# EAGLE design 2021-04-14 BOSS-RoboClaw-Breakout (EAGLE 9.6.2)
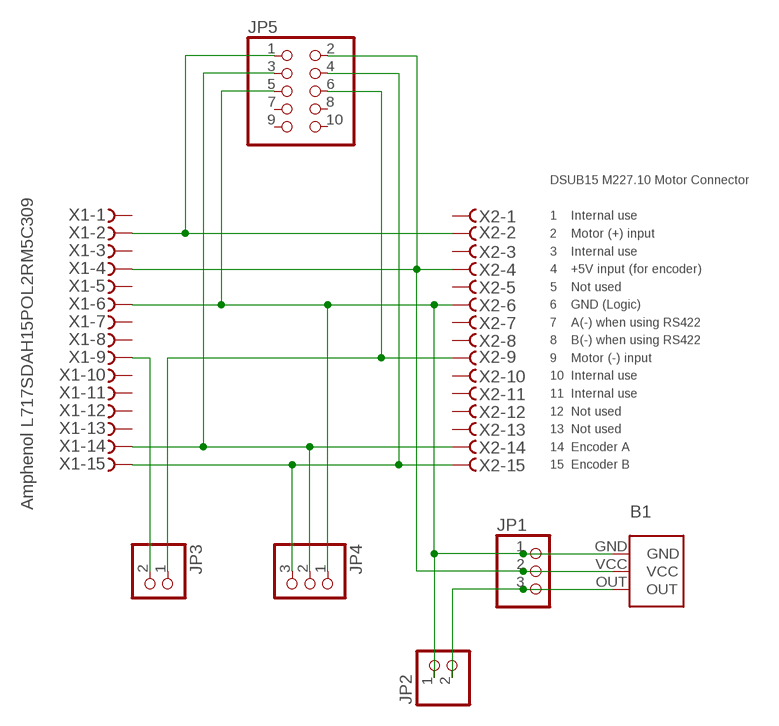
[diagram p0: schematic, sheet 1]

## Parts
B1  ACS724CARRIER  [ACS724CARRIER]
JP1  PINHD-1X3  [1X03]
JP2  PINHD-1X2  [1X02]
JP3  PINHD-1X2  [1X02]
JP4  PINHD-1X3  [1X03]
JP5  PINHD-2X5  [2X05]
X1  Amphenol L717SDAH15POL2RM5C309  D-SUB15-H2M15ST  [H2M15ST]
X2  Amphenol L77SDAH15SOL2RM8C309  D-SUB15-H2R15ST  [H2R15ST]

## Nets
ENCA: JP4.2 JP5.3 X1.14 X2.14
ENCB: JP4.3 JP5.4 X1.15 X2.15
GND: B1.GND JP1.1 JP2.1 JP4.1 JP5.5 X1.6 X2.6
M+: JP5.1 X1.2 X2.2
M-: JP3.1 JP5.6 X2.9
N$5: JP3.2 X1.9
OUT: B1.OUT JP1.3 JP2.2
VCC: B1.VCC JP1.2 JP5.2 X1.4 X2.4
Unconnected: JP5.7 JP5.8 JP5.9 JP5.10 X1.1 X1.3 X1.5 X1.7 X1.8 X1.10 X1.11 X1.12 X1.13 X2.1 X2.3 X2.5 X2.7 X2.8 X2.10 X2.11 X2.12 X2.13

## Notes on the sheet
- DSUB15 M227.10 Motor Connector
  
  1    Internal use
  2    Motor (+) input
  3    Internal use
  4    +5V input (for encoder)
  5    Not used
  6    GND (Logic)
  7    A(-) when using RS422
  8    B(-) when using RS422
  9    Motor (-) input
  10  Internal use
  11  Internal use
  12  Not used
  13  Not used
  14  Encoder A
  15  Encoder B

## Library data of the parts
B1 = AUmlib:ACS724CARRIER: Pololu ACS724 carrier board Pololu part 4041 is +/-5A 400mV/A
JP1 JP4 = AUmlib:PINHD-1X3: PIN HEADER
JP2 JP3 = AUmlib:PINHD-1X2: PIN HEADER
JP5 = AUmlib:PINHD-2X5: PIN HEADER
X1 X2 = AUmlib:D-SUB15-: D-Subminiatur Connector Source: Electronioc Interconnects European Edition 1998; OC_FARNELL: unknown; OC_NEWARK: unknown

## Board
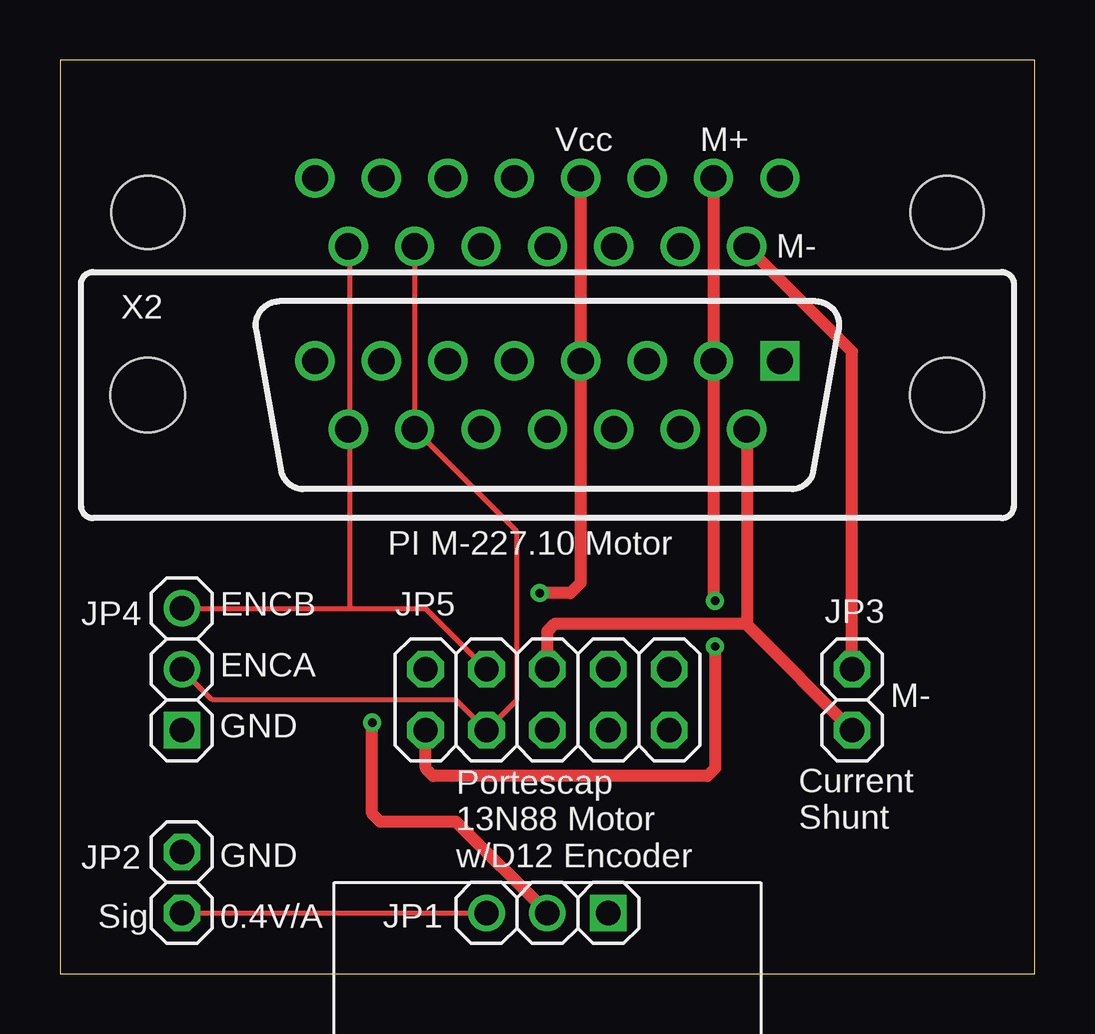
[diagram p1: board, top side]
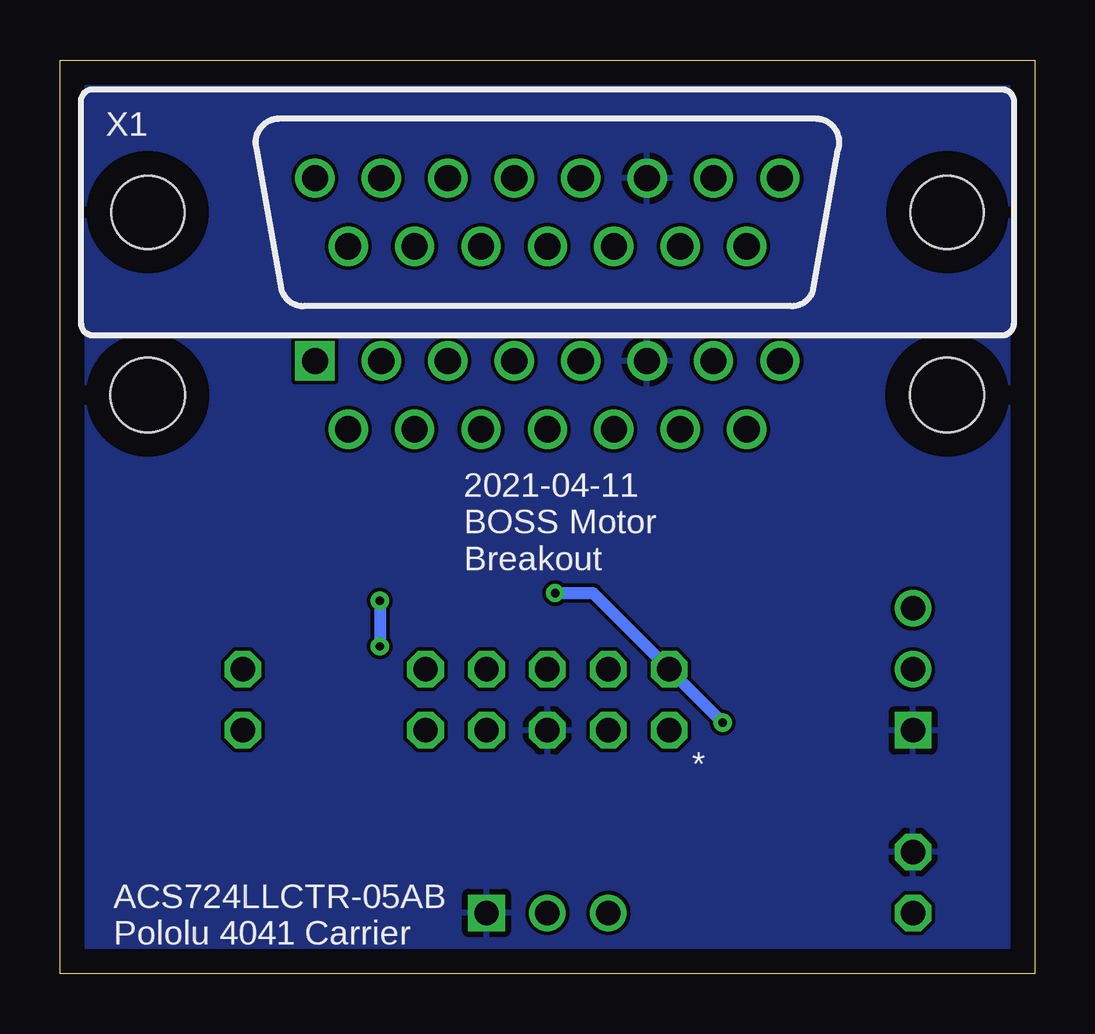
[diagram p2: board, bottom side, seen from below]

Size 40.64 x 38.1 mm. Coordinates in mm from the lower left corner, seen from the top.
Outline: 0,0 40.64,0 40.64,38.1 0,38.1 0,0
Copper layers (1*16): Top 0.035mm / dielectric 1.5mm / Bottom 0.035mm
Design rules "default": minimum track width 6mil, minimum drill 0.35mm, track to track 6mil, track to pad 6mil, pad to pad 6mil, via to via 6mil, smd to smd 6mil, copper to edge 40mil, drill to drill 6mil, minimum pad ring 10mil, minimum via ring 8mil, stop-mask expansion 4mil, vias tented up to drill 0mil, thermal gap 10mil

### Footprints (pad centres in the part's own frame; a part is rotated, then mirrored left to right if it is on the bottom)
ACS724CARRIER = drill 1.016 square: GND 1.27,11.43 | drill 1.016: OUT 1.27,6.35; VCC 1.27,8.89
1X03 = drill 1.016 square: 1 -2.54,0 | drill 1.016: 2 0,0; 3 2.54,0
1X02 = drill 1.016 octagon: 1 -1.27,0; 2 1.27,0
2X05 = drill 1.016 octagon: 1 -5.08,-1.27; 2 -5.08,1.27; 3 -2.54,-1.27; 4 -2.54,1.27; 5 0,-1.27; 6 0,1.27; 7 2.54,-1.27; 8 2.54,1.27; 9 5.08,-1.27; 10 5.08,1.27
H2M15ST = drill 1.092: 1 -9.69,1.422; 2 -6.921,1.422; 3 -4.153,1.422; 4 -1.384,1.422; 5 1.384,1.422; 6 4.153,1.422; 7 6.921,1.422; 8 9.69,1.422; 9 -8.306,-1.422; 10 -5.537,-1.422; 11 -2.769,-1.422; 12 0,-1.422; 13 2.769,-1.422; 14 5.537,-1.422; 15 8.306,-1.422 | hole 3.048: -16.662,0; 16.662,0
H2R15ST = drill 1.092 square: 1 9.69,1.422 | drill 1.092: 2 6.921,1.422; 3 4.153,1.422; 4 1.384,1.422; 5 -1.384,1.422; 6 -4.153,1.422; 7 -6.921,1.422; 8 -9.69,1.422; 9 8.306,-1.422; 10 5.537,-1.422; 11 2.769,-1.422; 12 0,-1.422; 13 -2.769,-1.422; 14 -5.537,-1.422; 15 -8.306,-1.422 | hole 3.1: -16.662,0; 16.662,0

### Placement (x,y rotation side)
B1  11.43,3.81 270 top
JP1  20.32,2.54 180 top
JP2  5.08,3.81 270 top
JP3  33.02,11.43 90 top
JP4  5.08,12.7 90 top
JP5  20.32,11.43 0 top
X1  20.32,31.75 0 bottom
X2  20.32,24.13 0 top

### Tracks (layer width: path | path; a pad name or v marks a point on that pad's centre or on a via)
ENCA
  Top 0.203: JP4.2 6.35,11.43 16.51,11.43 JP5.3 19.05,11.43 19.05,18.44 X2.14 X1.14
ENCB
  Top 0.203: JP4.3 12.06,15.24 | 12.06,15.24 15.24,15.24 JP5.4 | X2.15 12.06,22.66 | 12.06,22.66 12.06,15.24 | X1.15 12.06,30.28 12.06,22.66
GND
  pour Bottom: 0,0 0,38.1 40.64,38.1 40.64,0
M+  (via drill 0.35)
  Top 0.508: X1.2 X2.2 27.24,15.62 v27.3,15.56 | v27.3,13.65 27.3,8.57 26.99,8.26 15.56,8.26 15.24,8.57 JP5.1
  Bottom 0.508: v27.3,15.56 v27.3,13.65
M-
  Top 0.508: JP5.6 20.32,14.29 20.64,14.61 28.57,14.61 28.63,14.55 | JP3.1 28.73,14.45 28.63,14.55 | X2.9 28.63,14.55
N$5
  Top 0.508: JP3.2 33.02,25.93 X1.9
OUT
  Top 0.203: JP2.2 B1.OUT
VCC  (via drill 0.35)
  Top 0.508: X1.4 X2.4 21.7,16.31 21.27,15.88 v20,15.88 | B1.VCC 16.51,6.35 13.34,6.35 13.02,6.67 v13.02,10.48
  Bottom 0.508: v20,15.88 18.41,15.88 JP5.2 v13.02,10.48

### Text on the board
tPlace: Vcc | M+ | M- | PI M-227.10 Motor | ENCB | ENCA | M- | GND | Current / Shunt | GND | Portescap / 13N88 Motor / w/D12 Encoder | Sig | 0.4V/A
bPlace: 2021-04-11 / BOSS Motor / Breakout | * | ACS724LLCTR-05AB / Pololu 4041 Carrier